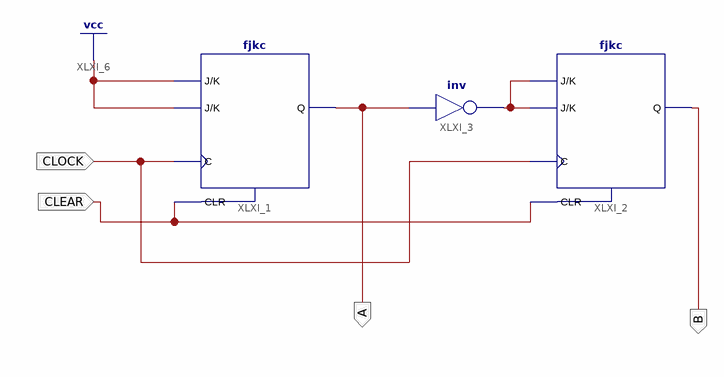
[diagram p0: schematic sheet 1]
// Xilinx ISE schematic down_counter_3bit.sch (artix7) as structural Verilog: 3 symbols, 4 ports
module down_counter_3bit (
  input  CLOCK,
  input  CLEAR,
  output A,
  output B
);

  wire XLXN_3;

  fjkc XLXI_1 (.C(CLOCK), .CLR(CLEAR), .J(1'b1), .K(1'b1), .Q(A));
  fjkc XLXI_2 (.C(CLOCK), .CLR(CLEAR), .J(XLXN_3), .K(XLXN_3), .Q(B));
  not XLXI_3 (XLXN_3, A);
endmodule
